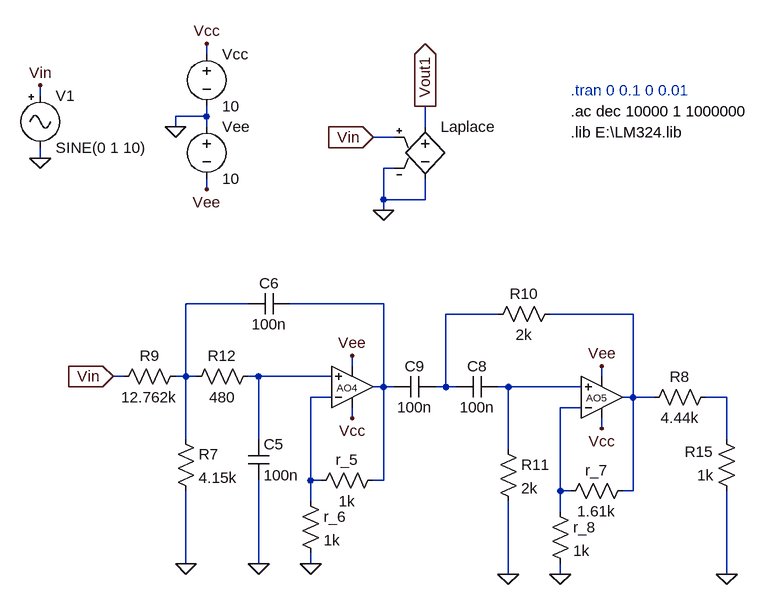
[diagram p0: schematic Filtro_Diseno_2.asc]
Filtro_Diseno_2.asc, the LTspice schematic file:
Version 4.1
SHEET 1 1376 980
WIRE -64 -416 -64 -432
WIRE -320 -352 -320 -368
WIRE -64 -320 -64 -336
WIRE -64 -320 -112 -320
WIRE -112 -304 -112 -320
WIRE -64 -304 -64 -320
WIRE 272 -304 272 -336
WIRE 224 -288 192 -288
WIRE -320 -256 -320 -272
WIRE 224 -240 208 -240
WIRE -64 -208 -64 -224
WIRE 208 -192 208 -240
WIRE 272 -192 272 -224
WIRE 272 -192 208 -192
WIRE 208 -176 208 -192
WIRE 0 -32 -96 -32
WIRE 208 -32 64 -32
WIRE 384 -16 304 -16
WIRE 592 -16 464 -16
WIRE 160 64 160 48
WIRE -192 80 -208 80
WIRE -96 80 -96 -32
WIRE -96 80 -112 80
WIRE -80 80 -96 80
WIRE 16 80 0 80
WIRE 128 80 16 80
WIRE 544 80 544 64
WIRE 208 96 208 -32
WIRE 208 96 192 96
WIRE 224 96 208 96
WIRE 304 96 304 -16
WIRE 304 96 288 96
WIRE 320 96 304 96
WIRE 400 96 384 96
WIRE 512 96 400 96
WIRE 128 112 96 112
WIRE 592 112 592 -16
WIRE 592 112 576 112
WIRE 624 112 592 112
WIRE 736 112 704 112
WIRE 512 128 480 128
WIRE 160 144 160 128
WIRE 544 160 544 144
WIRE -96 176 -96 80
WIRE 16 176 16 80
WIRE 736 176 736 112
WIRE 400 192 400 96
WIRE 96 240 96 112
WIRE 112 240 96 240
WIRE 208 240 208 96
WIRE 208 240 192 240
WIRE 480 256 480 128
WIRE 496 256 480 256
WIRE 592 256 592 112
WIRE 592 256 576 256
WIRE 96 272 96 240
WIRE 480 288 480 256
WIRE -96 368 -96 256
WIRE 16 368 16 240
WIRE 96 368 96 352
WIRE 400 384 400 272
WIRE 480 384 480 368
WIRE 736 384 736 256
FLAG -112 -304 0
FLAG -64 -432 Vcc
FLAG -64 -208 Vee
FLAG -320 -368 Vin
FLAG -320 -256 0
FLAG 208 -176 0
FLAG 272 -336 Vout1
IOPIN 272 -336 Out
FLAG 192 -288 Vin
IOPIN 192 -288 In
FLAG 160 144 Vcc
FLAG 160 48 Vee
FLAG 96 368 0
FLAG 16 368 0
FLAG -208 80 Vin
IOPIN -208 80 In
FLAG 544 160 Vcc
FLAG 544 64 Vee
FLAG 480 384 0
FLAG 400 384 0
FLAG -96 368 0
FLAG 736 384 0
SYMBOL voltage -64 -432 R0
WINDOW 123 0 0 Left 0
WINDOW 39 0 0 Left 0
SYMATTR InstName Vcc
SYMATTR Value 10
SYMBOL voltage -64 -320 R0
WINDOW 123 0 0 Left 0
WINDOW 39 0 0 Left 0
SYMATTR InstName Vee
SYMATTR Value 10
SYMBOL Misc\\signal -320 -368 R0
WINDOW 39 0 0 Left 0
SYMATTR InstName V1
SYMATTR Value SINE(0 1 10)
SYMATTR Value2 AC 1
SYMBOL e 272 -320 R0
WINDOW 3 24 44 Invisible 2
SYMATTR Value Laplace{1.642E07*s**2/(s**4 + 5080*s**3 + 9.586E07*s**2 +  2.006E11*s + 1.558E15)}
SYMATTR InstName Laplace
SYMBOL res -96 64 R90
WINDOW 0 0 56 VBottom 2
WINDOW 3 32 56 VTop 2
SYMATTR InstName R9
SYMATTR Value 12.762k
SYMBOL res 208 224 R90
WINDOW 0 0 56 VBottom 2
WINDOW 3 32 56 VTop 2
SYMATTR InstName r_5
SYMATTR Value 1k
SYMBOL res 80 256 R0
SYMATTR InstName r_6
SYMATTR Value 1k
SYMBOL OpAmps\\opamp2 160 160 M180
WINDOW 0 -24 63 Left 1
WINDOW 3 16 96 Invisible 2
SYMATTR InstName AO4
SYMATTR Value LM324
SYMBOL res 16 64 R90
WINDOW 0 0 56 VBottom 2
WINDOW 3 32 56 VTop 2
SYMATTR InstName R12
SYMATTR Value 480
SYMBOL cap 0 176 R0
SYMATTR InstName C5
SYMATTR Value 100n
SYMBOL cap 64 -48 R90
WINDOW 0 0 32 VBottom 2
WINDOW 3 32 32 VTop 2
SYMATTR InstName C6
SYMATTR Value 100n
SYMBOL res 592 240 R90
WINDOW 0 0 56 VBottom 2
WINDOW 3 32 56 VTop 2
SYMATTR InstName r_7
SYMATTR Value 1.61k
SYMBOL res 464 272 R0
SYMATTR InstName r_8
SYMATTR Value 1k
SYMBOL OpAmps\\opamp2 544 176 M180
WINDOW 0 -24 63 Left 1
WINDOW 3 16 96 Invisible 2
SYMATTR InstName AO5
SYMATTR Value LM324
SYMBOL cap 384 80 R90
WINDOW 0 0 32 VBottom 2
WINDOW 3 32 32 VTop 2
SYMATTR InstName C8
SYMATTR Value 100n
SYMBOL cap 224 80 M90
WINDOW 0 0 32 VBottom 2
WINDOW 3 32 32 VTop 2
SYMATTR InstName C9
SYMATTR Value 100n
SYMBOL res 480 -32 R90
WINDOW 0 0 56 VBottom 2
WINDOW 3 32 56 VTop 2
SYMATTR InstName R10
SYMATTR Value 2k
SYMBOL res 384 176 R0
SYMATTR InstName R11
SYMATTR Value 2k
SYMBOL res -112 160 R0
SYMATTR InstName R7
SYMATTR Value 4.15k
SYMBOL res 720 96 R90
WINDOW 0 0 56 VBottom 2
WINDOW 3 32 56 VTop 2
SYMATTR InstName R8
SYMATTR Value 4.44k
SYMBOL res 752 272 R180
WINDOW 0 36 76 Left 2
WINDOW 3 36 40 Left 2
SYMATTR InstName R15
SYMATTR Value 1k
TEXT 496 -360 Left 2 ;.tran 0 0.1 0 0.01
TEXT 496 -328 Left 2 !.ac dec 10000 1 1000000
TEXT 496 -296 Left 2 !.lib E:\\LM324.lib

The netlist it stands for:
* Filtro_Diseno_2.asc
Vcc Vcc 0 10
Vee 0 Vee 10
V1 Vin 0 SINE(0 1 10) AC 1
E§Laplace Vout1 0 Vin 0 Laplace{1.642E07*s**2/(s**4 + 5080*s**3 + 9.586E07*s**2 +  2.006E11*s + 1.558E15)}
R9 N001 Vin 12.762k
r_5 N002 N007 1k
r_6 N007 0 1k
X§AO4 N005 N007 Vcc Vee N002 LM324  ; pins In+ In- V+ V- OUT
R12 N005 N001 480
C5 N005 0 100n
C6 N002 N001 100n
r_7 N004 N009 1.61k
r_8 N009 0 1k
X§AO5 N006 N009 Vcc Vee N004 LM324  ; pins In+ In- V+ V- OUT
C8 N006 N003 100n
C9 N002 N003 100n
R10 N004 N003 2k
R11 N006 0 2k
R7 N001 0 4.15k
R8 N008 N004 4.44k
R15 0 N008 1k
* .tran 0 0.1 0 0.01
.ac dec 10000 1 1000000
.lib E:\LM324.lib
.backanno
.end